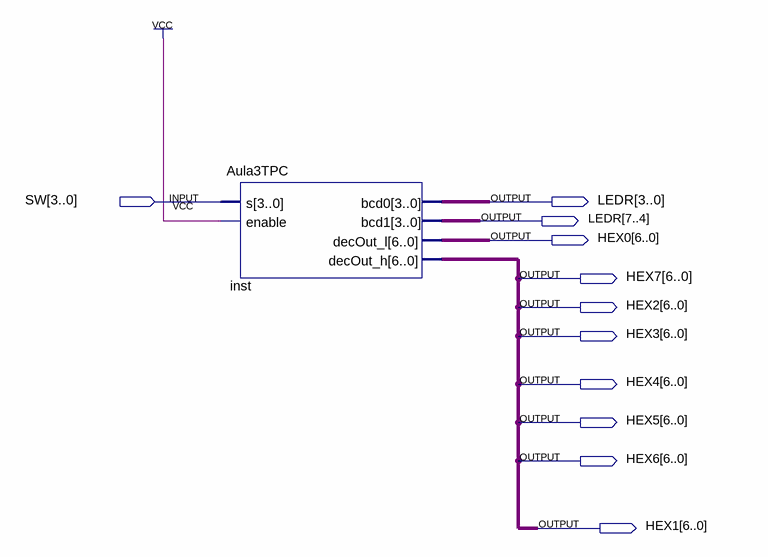
[diagram p0: schematic sheet]
// Quartus schematic Block2.bdf as structural Verilog: 1 symbols, 11 pins
module Block2 (
  input  [3:0] SW,
  output [7:0] LEDR,
  output [6:0] HEX0,
  output [6:0] HEX7,
  output [6:0] HEX2,
  output [6:0] HEX3,
  output [6:0] HEX4,
  output [6:0] HEX5,
  output [6:0] HEX6,
  output [6:0] HEX1
);

  Aula3TPC inst (.s(SW), .enable(1'b1), .bcd0(LEDR[3:0]), .bcd1(LEDR[7:4]), .decOut_l(HEX0), .decOut_h(HEX1));

  assign HEX2 = HEX1;
  assign HEX3 = HEX1;
  assign HEX4 = HEX1;
  assign HEX5 = HEX1;
  assign HEX6 = HEX1;
  assign HEX7 = HEX1;
endmodule
